# EAGLE design HWK_2_Schematic (EAGLE 9.3.0)
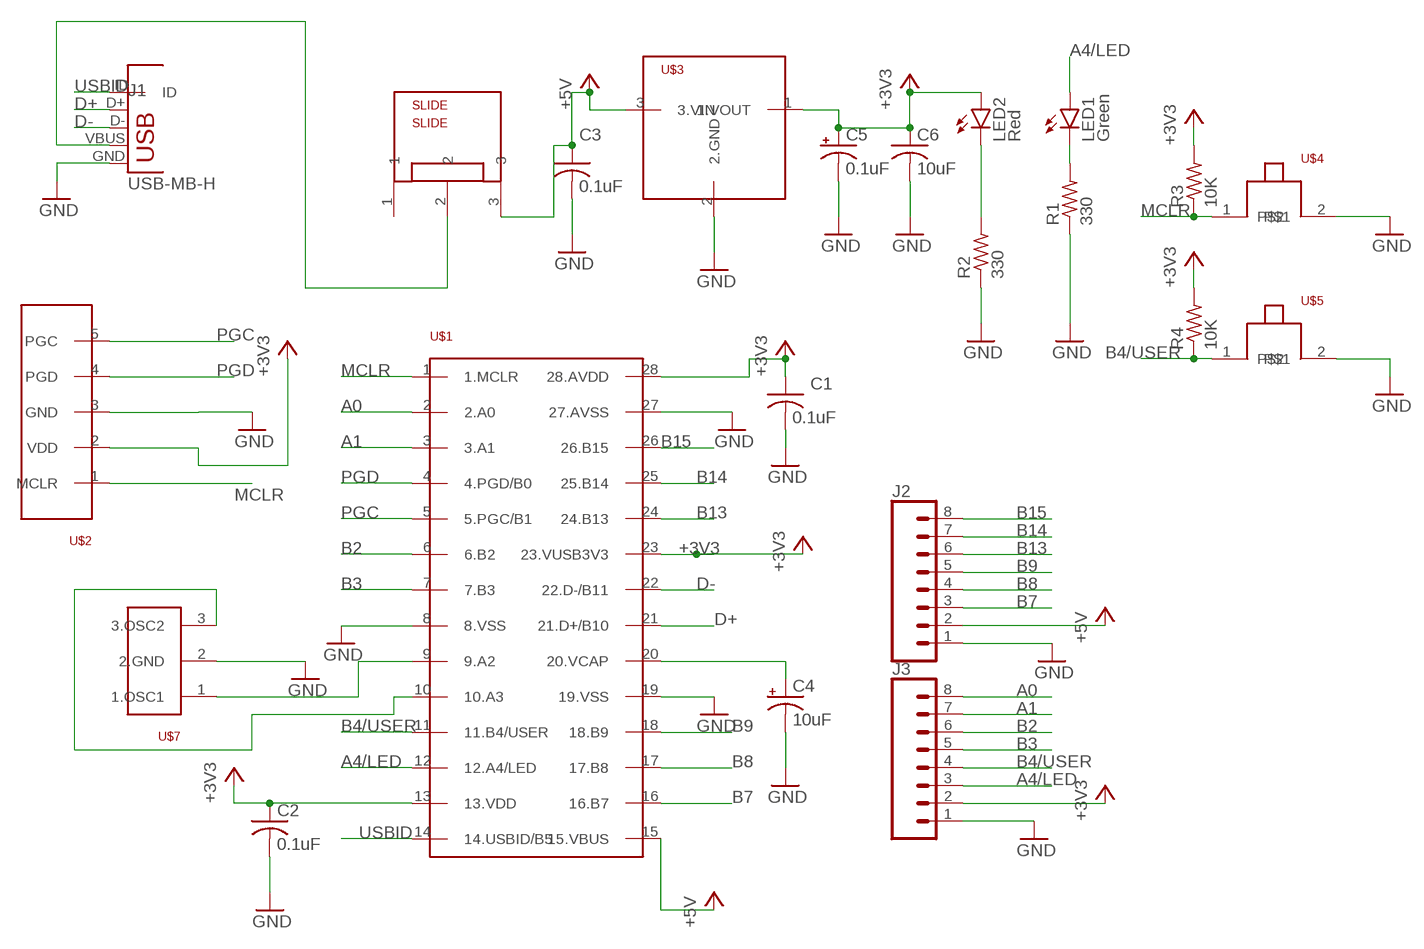
[diagram p0: schematic, sheet 1]

## Parts
C1  0.1uF  C-US025-025X050  [C025-025X050]
C2  0.1uF  C-US025-025X050  [C025-025X050]
C3  0.1uF  C-US025-025X050  [C025-025X050]
C4  10uF  CPOL-USB45181B  [B45181B]
C5  0.1uF  CPOL-USB45181B  [B45181B]
C6  10uF  C-US025-025X050  [C025-025X050]
J1  USB-MB-H  [USB-MB-H]
J2  CONN_08NO_SILK_FEMALE_PTH  [1X08_NO_SILK]
J3  CONN_08NO_SILK_FEMALE_PTH  [1X08_NO_SILK]
LED1  Green  LED3MM  [LED3MM]
LED2  Red  LED3MM  [LED3MM]
R1  330  R-US_0207/10  [0207/10]
R2  330  R-US_0207/10  [0207/10]
R3  10K  R-US_0207/10  [0207/10]
R4  10K  R-US_0207/10  [0207/10]
SLIDE  SLIDE  [SLIDE]
U$1  PIC32MX250F128B  [DIL28-3]
U$2  PICKIT3  [PICKIT3]
U$3  VOLTAGE_REGULATOR  [TO92]
U$4  PUSH_BUTTON  [PUSH_BUTTON]
U$5  USER_BUTTON  PUSH_BUTTON  [PUSH_BUTTON]
U$7  8MHz  OSC  [OSC]

## Nets
+3V3: C1.1 C2.1 C5.+ C6.1 J3.2 LED2.A R3.2 R4.2 U$1.13(13.VDD) U$1.23(23.VUSB3V3) U$1.28(28.AVDD) U$2.2(VDD) U$3.1(1.VOUT)
+5V: C3.1 J2.2 SLIDE.3 U$1.15(15.VBUS) U$3.3(3.VIN)
A0: J3.8 U$1.2(2.A0)
A1: J3.7 U$1.3(3.A1)
A4/LED: J3.3 LED1.A U$1.12(12.A4/LED)
B2: J3.6 U$1.6(6.B2)
B3: J3.5 U$1.7(7.B3)
B4/USER: J3.4 R4.1 U$1.11(11.B4/USER) U$5.1
B7: J2.3 U$1.16(16.B7)
B8: J2.4 U$1.17(17.B8)
B9: J2.5 U$1.18(18.B9)
B13: J2.6 U$1.24(24.B13)
B14: J2.7 U$1.25(25.B14)
B15: J2.8 U$1.26(26.B15)
D+: J1.D+ U$1.21(21.D+/B10)
D-: J1.D- U$1.22(22.D-/B11)
GND: C1.2 C2.2 C3.2 C4.- C5.- C6.2 J1.GND J2.1 J3.1 R1.1 R2.1 U$1.8(8.VSS) U$1.19(19.VSS) U$1.27(27.AVSS) U$2.3(GND) U$3.2(2.GND) U$4.2 U$5.2 U$7.2(2.GND)
MCLR: R3.1 U$1.1(1.MCLR) U$2.1(MCLR) U$4.1
N$1: U$1.9(9.A2) U$7.1(1.OSC1)
N$2: J1.VBUS SLIDE.2
N$3: LED2.K(C) R2.2
N$4: U$1.10(10.A3) U$7.3(3.OSC2)
N$5: C4.+ U$1.20(20.VCAP)
N$6: LED1.K(C) R1.2
PGC: U$1.5(5.PGC/B1) U$2.5(PGC)
PGD: U$1.4(4.PGD/B0) U$2.4(PGD)
USBID: J1.ID U$1.14(14.USBID/B5)
Unconnected: SLIDE.1

## Library data of the parts
C1-C3 C6 = Hwk2_library:C-US: CAPACITOR, American symbol; SPICEPREFIX: C
C4 C5 = Hwk2_library:CPOL-US: POLARIZED CAPACITOR, American symbol; SPICEPREFIX: C
J1 = Hwk2_library:USB: USB Connectors USB-B-PTH is fully proven SKU : PRT-00139/CONN-08278 USB-miniB is fully proven SKU : PRT-00587 USB-A-PCB is untested. USB-A-H is throughly reviewed, but untested. Spark Fun Electronics SKU : PRT-00437 USB-B-SMT is throughly reviewed, but untested. Needs silkscreen touching up. USB-A-S has not been used/tested USB-MB-H has not been used/tested USB-MICROB has been used. CONN-09505
J2 J3 = Hwk2_library:CONN_08: Multi connection point. Often used as Generic Header-pin footprint for 0.1 inch spaced/style header connections On any of the 0.1 inch spaced packages, you can populate with these: Break Away Headers - Straight <https://www.sparkfun.com/products/116> (PRT-00116) Break Away Male Headers - Right Angle <https://www.sparkfun.com/products/553> (PRT-00553) Female Headers <https://www.sparkfun.com/products/115> (PRT-00115) Break Away Headers - Machine Pin <https://www.sparkfun.com/products/117> (PRT-00117) Break Away Female Headers - Swiss Machine Pin <https://www.sparkfun.com/products/743> (PRT-00743) Arduino Stackable Header - 8 Pin <https://www.sparkfun.com/products/9279> (PRT-09279) For SCREWTERMINALS and SPRING TERMINALS visit here: Screw Terimnals on SparkFun.com <https://www.sparkfun.com/search/results?term=Screw+Terminals> (5mm/3.5mm/2.54mm spacing) This device is also useful as a general connection point to wire up your design to another part of your project. Our various solder wires solder well into these plated through hole pads. Hook-Up Wire - Assortment (Stranded, 22 AWG) <https://www.sparkfun.com/products/11375> (PRT-11375) Hook-Up Wire - Assortment (Solid Core, 22 AWG) <https://www.sparkfun.com/products/11367> (PRT-11367) View the entire wire category on our website here <https://www.sparkfun.com/categories/141> Special notes: Molex polarized connector foot print use with SKU : PRT-08231 with associated crimp pins and housings. 1MM SMD Version SKU: PRT-10208 NOTES ON THE VARIANTS LOCK and LOCK_LONGPADS... This footprint was designed to help hold the alignment of a through-hole component (i.e. 6-pin header) while soldering it into place. You may notice that each hole has been shifted either up or down by 0.005 of an inch from it's more standard position (which is a perfectly straight line). This slight alteration caused the pins (the squares in the middle) to touch the edges of the holes. Because they are alternating, it causes a "brace" to hold the component in place. 0.005 has proven to be the perfect amount of "off-center" position when using our standard breakaway headers. Although looks a little odd when you look at the bare footprint, once you have a header in there, the alteration is very hard to notice. Also,if you push a header all the way into place, it is covered up entirely on the bottom side.; PROD_ID: CONN-08438
LED1 LED2 = Hwk2_library:LED: LED OSRAM: - CHIPLED LG R971, LG N971, LY N971, LG Q971, LY Q971, LO R971, LY R971 LH N974, LH R974 LS Q976, LO Q976, LY Q976 LO Q996 - Hyper CHIPLED LW Q18S LB Q993, LB Q99A, LB R99A - SideLED LS A670, LO A670, LY A670, LG A670, LP A670 LB A673, LV A673, LT A673, LW A673 LH A674 LY A675 LS A676, LA A676, LO A676, LY A676, LW A676 LS A679, LY A679, LG A679 - Hyper Micro SIDELED® LS Y876, LA Y876, LO Y876, LY Y876 LT Y87S - SmartLED LW L88C, LW L88S LB L89C, LB L89S, LG L890 LS L89K, LO L89K, LY L89K LS L896, LA L896, LO L896, LY L896 - TOPLED LS T670, LO T670, LY T670, LG T670, LP T670 LSG T670, LSP T670, LSY T670, LOP T670, LYG T670 LG T671, LOG T671, LSG T671 LB T673, LV T673, LT T673, LW T673 LH T674 LS T676, LA T676, LO T676, LY T676, LB T676, LH T676, LSB T676, LW T676 LB T67C, LV T67C, LT T67C, LS T67K, LO T67K, LY T67K, LW E67C LS E67B, LA E67B, LO E67B, LY E67B, LB E67C, LV E67C, LT E67C LW T67C LS T679, LY T679, LG T679 LS T770, LO T770, LY T770, LG T770, LP T770 LB T773, LV T773, LT T773, LW T773 LH T774 LS E675, LA E675, LY E675, LS T675 LS T776, LA T776, LO T776, LY T776, LB T776 LHGB T686 LT T68C, LB T68C - Hyper Mini TOPLED® LB M676 - Mini TOPLED Santana® LG M470 LS M47K, LO M47K, LY M47K Source: http://www.osram.convergy.de LUXEON: - LUMILED® LXK2-PW12-R00, LXK2-PW12-S00, LXK2-PW14-U00, LXK2-PW14-V00 LXK2-PM12-R00, LXK2-PM12-S00, LXK2-PM14-U00 LXK2-PE12-Q00, LXK2-PE12-R00, LXK2-PE12-S00, LXK2-PE14-T00, LXK2-PE14-U00 LXK2-PB12-K00, LXK2-PB12-L00, LXK2-PB12-M00, LXK2-PB14-N00, LXK2-PB14-P00, LXK2-PB14-Q00 LXK2-PR12-L00, LXK2-PR12-M00, LXK2-PR14-Q00, LXK2-PR14-R00 LXK2-PD12-Q00, LXK2-PD12-R00, LXK2-PD12-S00 LXK2-PH12-R00, LXK2-PH12-S00 LXK2-PL12-P00, LXK2-PL12-Q00, LXK2-PL12-R00 Source: www.luxeon.com KINGBRIGHT: KA-3528ASYC Source: www.kingbright.com
R1-R4 = Hwk2_library:R-US_: RESISTOR, American symbol; SPICEPREFIX: R
SLIDE = Hwk2_library:SLIDE
U$1 = Hwk2_library:PIC32MX250F128B
U$2 = Hwk2_library:PICKIT3
U$3 = Hwk2_library:VOLTAGE_REGULATOR
U$4 U$5 = Hwk2_library:PUSH_BUTTON
U$7 = Hwk2_library:OSC

## Board
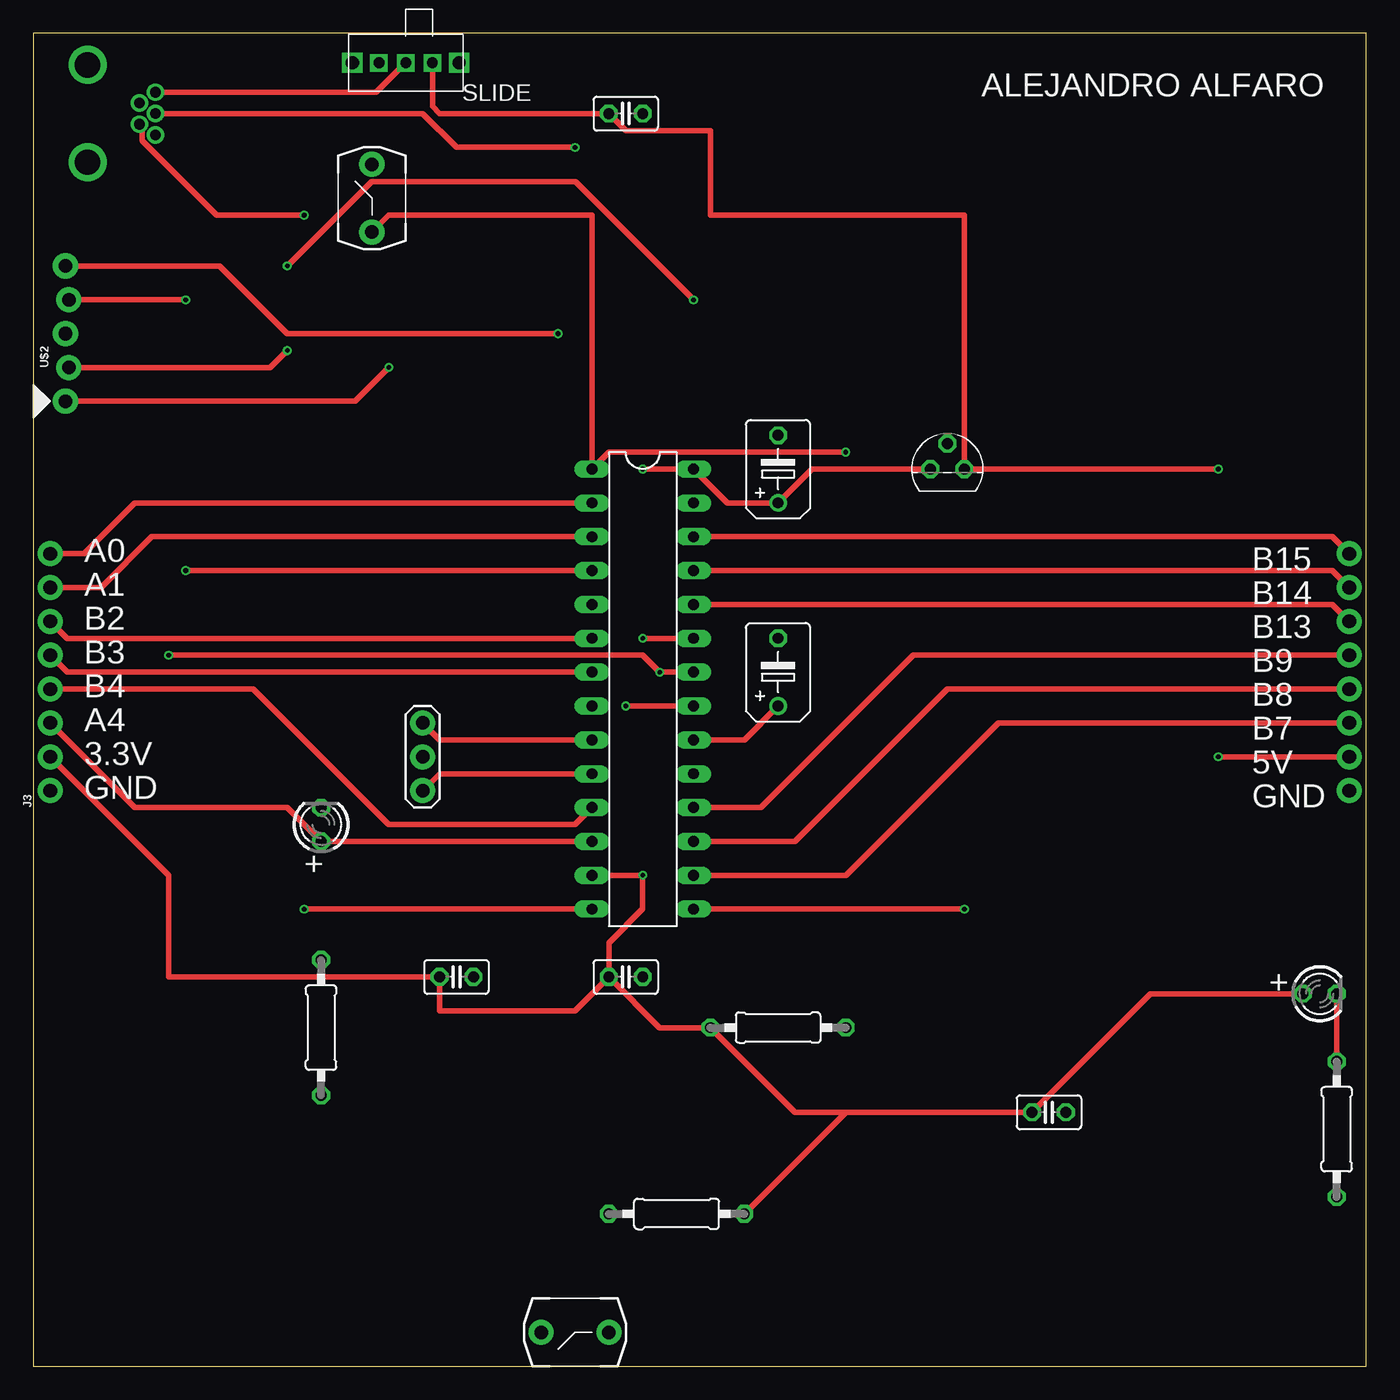
[diagram p1: board, top side]
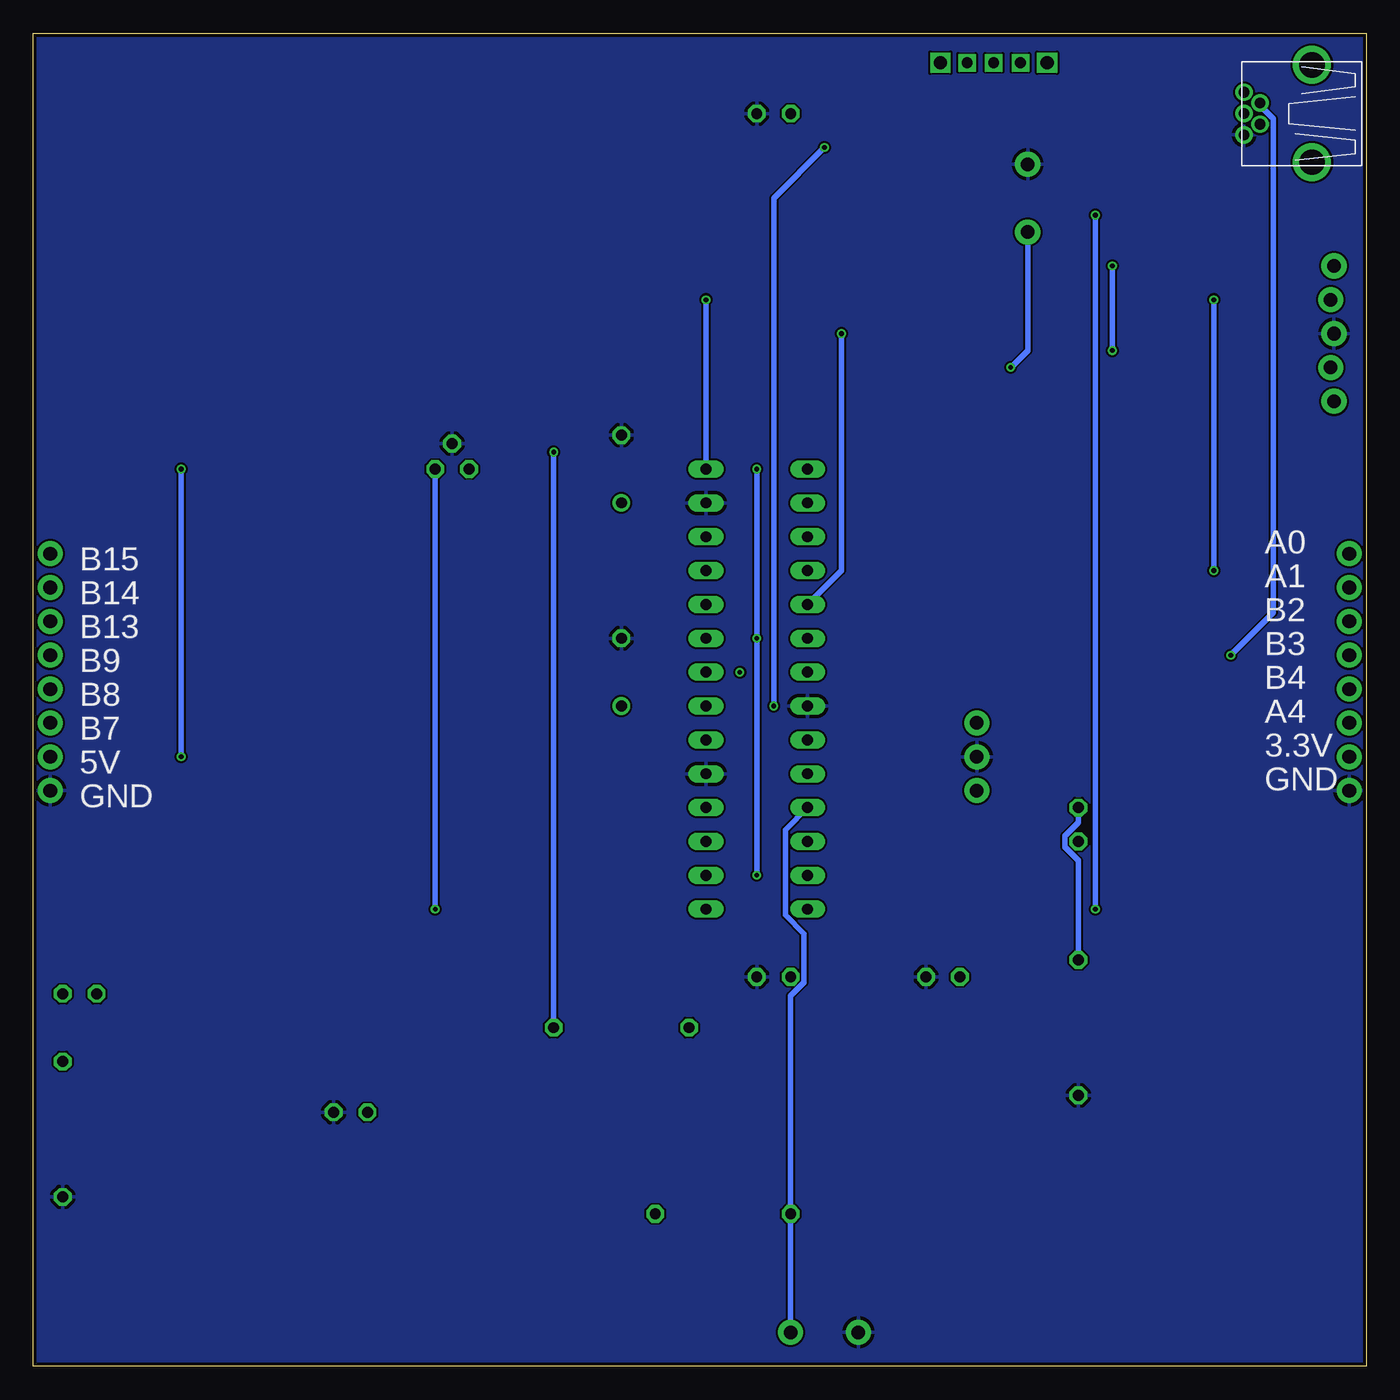
[diagram p2: board, bottom side, seen from below]

Size 100 x 100 mm. Coordinates in mm from the lower left corner, seen from the top.
Outline: 0,0 100,0 100,100 0,100 0,0
Copper layers (1*16): Top 0.035mm / dielectric 1.5mm / Bottom 0.035mm
Design rules "SeeedStudio_2layer_DRU_no_angle_20140221": minimum track width 6mil, minimum drill 12mil, track to track 6mil, track to pad 6mil, pad to pad 6mil, via to via 6mil, smd to smd 0mil, copper to edge 10mil, drill to drill 10mil, minimum pad ring 10mil, minimum via ring 6mil, stop-mask expansion 2mil, vias tented up to drill 100mil, thermal gap 10mil

### Footprints (pad centres in the part's own frame; a part is rotated, then mirrored left to right if it is on the bottom)
C025-025X050 = drill 0.813 octagon: 1 -1.27,0; 2 1.27,0
B45181B = drill 0.813: + -2.54,0 | drill 0.813 octagon: - 2.54,0
USB-MB-H = drill 0.8: D+ 5.1,0; D- 3.9,0.8; GND 5.1,-1.6; ID 3.9,-0.8; VBUS 5.1,1.6 | drill 1.9: P$6 0,-3.65; P$7 0,3.65
1X08_NO_SILK = drill 1.016 pad 1.88: 1 0,0; 2 2.54,0; 3 5.08,0; 4 7.62,0; 5 10.16,0; 6 12.7,0; 7 15.24,0; 8 17.78,0
LED3MM = drill 0.813 octagon: A -1.27,0; K 1.27,0
0207/10 = drill 0.813 octagon: 1 -5.08,0; 2 5.08,0
SLIDE = drill 0.8 square: 1 -2,0; 2 0,0; 3 2,0 | drill 1 square: P$4 -4,0; P$5 4,0
DIL28-3 = drill 0.813 long: 1 -16.51,-3.81; 2 -13.97,-3.81; 3 -11.43,-3.81; 4 -8.89,-3.81; 5 -6.35,-3.81; 6 -3.81,-3.81; 7 -1.27,-3.81; 8 1.27,-3.81; 9 3.81,-3.81; 10 6.35,-3.81; 11 8.89,-3.81; 12 11.43,-3.81; 13 13.97,-3.81; 14 16.51,-3.81; 15 16.51,3.81; 16 13.97,3.81; 17 11.43,3.81; 18 8.89,3.81; 19 6.35,3.81; 20 3.81,3.81; 21 1.27,3.81; 22 -1.27,3.81; 23 -3.81,3.81; 24 -6.35,3.81; 25 -8.89,3.81; 26 -11.43,3.81; 27 -13.97,3.81; 28 -16.51,3.81
PICKIT3 = drill 1.016 pad 1.88: 1 0,0.127; 2 2.54,-0.127; 3 5.08,0.127; 4 7.62,-0.127; 5 10.16,0.127
TO92 = drill 0.813 octagon: 1 -1.27,0; 2 0,1.905; 3 1.27,0
PUSH_BUTTON = drill 1.016 pad 1.88: 1 -2.54,0; 2 2.54,0
OSC = drill 1.016 pad 1.88: 1 -2.54,0; 2 0,0; 3 2.54,0

### Placement (x,y rotation side)
C1  31.75,29.21 0 top
C2  76.2,19.05 0 top
C3  44.45,93.98 0 top
C4  55.88,52.07 90 top
C5  55.88,67.31 90 top
C6  44.45,29.21 0 top
J1  4.06,93.98 0 top
J2  98.73,43.18 90 top
J3  1.27,43.18 90 top
LED1  21.59,40.64 90 top
LED2  96.52,27.94 0 top
R1  21.59,25.4 90 top
R2  97.79,17.78 90 top
R3  55.88,25.4 180 top
R4  48.26,11.43 0 top
SLIDE  27.94,97.79 0 top
U$1  45.72,50.8 270 top
U$2  2.54,72.39 90 top
U$3  68.58,67.31 0 top
U$4  25.4,87.63 90 top
U$5  40.64,2.54 180 top
U$7  29.21,45.72 270 top

### Tracks (layer width: path | path; a pad name or v marks a point on that pad's centre or on a via)
+3V3  (via drill 0.35)
  Top 0.406: U$3.1 58.42,67.31 C5.+ 52.07,64.77 U$1.28 v45.72,67.31 | U$1.13 v45.72,36.83 45.72,34.29 43.18,31.75 C6.1 | v45.72,54.61 U$1.23 | LED2.A 83.82,27.94 C2.1 60.96,19.05 | 60.96,19.05 R4.2 | 60.96,19.05 57.15,19.05 R3.2 46.99,25.4 C6.1 | C6.1 40.64,26.67 30.48,26.67 C1.1 10.16,29.21 10.16,36.83 J3.2 | v19.05,82.55 25.38,88.88 40.66,88.88 v49.53,80.01 | U$2.2 17.78,74.93 v19.05,76.2
  Bottom 0.406: v45.72,67.31 v45.72,54.61 v45.72,36.83 | v49.53,80.01 U$1.28 | v19.05,76.2 v19.05,82.55
+5V  (via drill 0.35)
  Top 0.406: SLIDE.3 29.94,94.52 30.48,93.98 C3.1 44.45,92.71 50.8,92.71 50.8,86.36 69.85,86.36 U$3.3 v88.9,67.31 | v69.85,34.29 U$1.15 | v88.9,45.72 J2.2
  Bottom 0.406: U$3.3 v69.85,34.29 | v88.9,67.31 v88.9,45.72
A0
  Top 0.406: J3.8 3.81,60.96 7.62,64.77 U$1.2
A1
  Top 0.406: J3.7 5.08,58.42 8.89,62.23 U$1.3
A4/LED
  Top 0.406: U$1.12 LED1.A 19.05,41.91 7.62,41.91 J3.3
B2
  Top 0.406: U$1.6 2.54,54.61 J3.6
B3
  Top 0.406: U$1.7 2.54,52.07 J3.5
B4/USER
  Top 0.406: J3.4 16.51,50.8 26.67,40.64 40.64,40.64 U$1.11
  Bottom 0.406: U$5.1 R4.1 43.18,27.77 42.16,28.79 42.16,32.45 43.59,33.87 43.59,40.23 U$1.11
B7
  Top 0.406: U$1.16 60.96,36.83 72.39,48.26 J2.3
B8
  Top 0.406: U$1.17 57.15,39.37 68.58,50.8 J2.4
B9
  Top 0.406: U$1.18 54.61,41.91 66.04,53.34 J2.5
B13
  Top 0.406: U$1.24 97.46,57.15 J2.6
B14
  Top 0.406: U$1.25 97.46,59.69 J2.7
B15
  Top 0.406: U$1.26 97.46,62.23 J2.8
D+  (via drill 0.35)
  Top 0.406: J1.D+ 29.21,93.98 31.75,91.44 v40.64,91.44 | U$1.21 v44.45,49.53
  Bottom 0.406: v44.45,49.53 44.45,87.63 v40.64,91.44
D-  (via drill 0.35)
  Top 0.406: U$1.22 v46.99,52.07 45.72,53.34 v10.16,53.34
  Bottom 0.406: J1.D- 7.96,94.61 6.95,93.6 6.95,56.55 v10.16,53.34
GND
  pour Bottom: 100.33,100.33 0,100.33 0,0 1.27,-1.27 99.06,-1.27 102.87,2.54 102.87,97.79
MCLR  (via drill 0.35)
  Top 0.406: U$4.1 26.67,86.36 41.91,86.36 U$1.1 43.18,68.58 v60.96,68.58 | U$2.1 24.13,72.39 v26.67,74.93
  Bottom 0.406: v26.67,74.93 25.4,76.2 U$4.1 | R3.1 v60.96,68.58
N$1
  Top 0.406: U$1.9 30.48,46.99 U$7.1
N$2
  Top 0.406: J1.VBUS 25.73,95.58 SLIDE.2
N$3
  Top 0.406: R2.2 LED2.K
N$4
  Top 0.406: U$1.10 30.48,44.45 U$7.3
N$5
  Top 0.406: U$1.20 53.34,46.99 C4.+
N$6
  Bottom 0.406: LED1.K 21.59,40.81 22.61,39.79 22.61,38.95 21.59,37.93 R1.2
PGC  (via drill 0.35)
  Top 0.406: U$2.5 13.97,82.55 19.05,77.47 v39.37,77.47
  Bottom 0.406: v39.37,77.47 39.37,59.69 U$1.5
PGD  (via drill 0.35)
  Top 0.406: v11.43,59.69 U$1.4 | U$2.4 v11.43,80.01
  Bottom 0.406: v11.43,80.01 v11.43,59.69
USBID  (via drill 0.35)
  Top 0.406: J1.ID 8.15,92.99 8.15,91.96 13.76,86.36 v20.32,86.36 | v20.32,34.29 U$1.14
  Bottom 0.406: v20.32,86.36 v20.32,34.29

### Text on the board
tPlace: ALEJANDRO ALFARO | A0 | B15 | A1 | B14 | B2 | B13 | B3 | B9 | B4 | B8 | A4 | B7 | 3.3V | 5V | GND | GND | + | +
bPlace: A0 | B15 | A1 | B14 | B2 | B13 | B3 | B9 | B4 | B8 | A4 | B7 | 3.3V | 5V | GND | GND